# EAGLE design uext-microsd (EAGLE 7.1.0)
REVISION: rev2
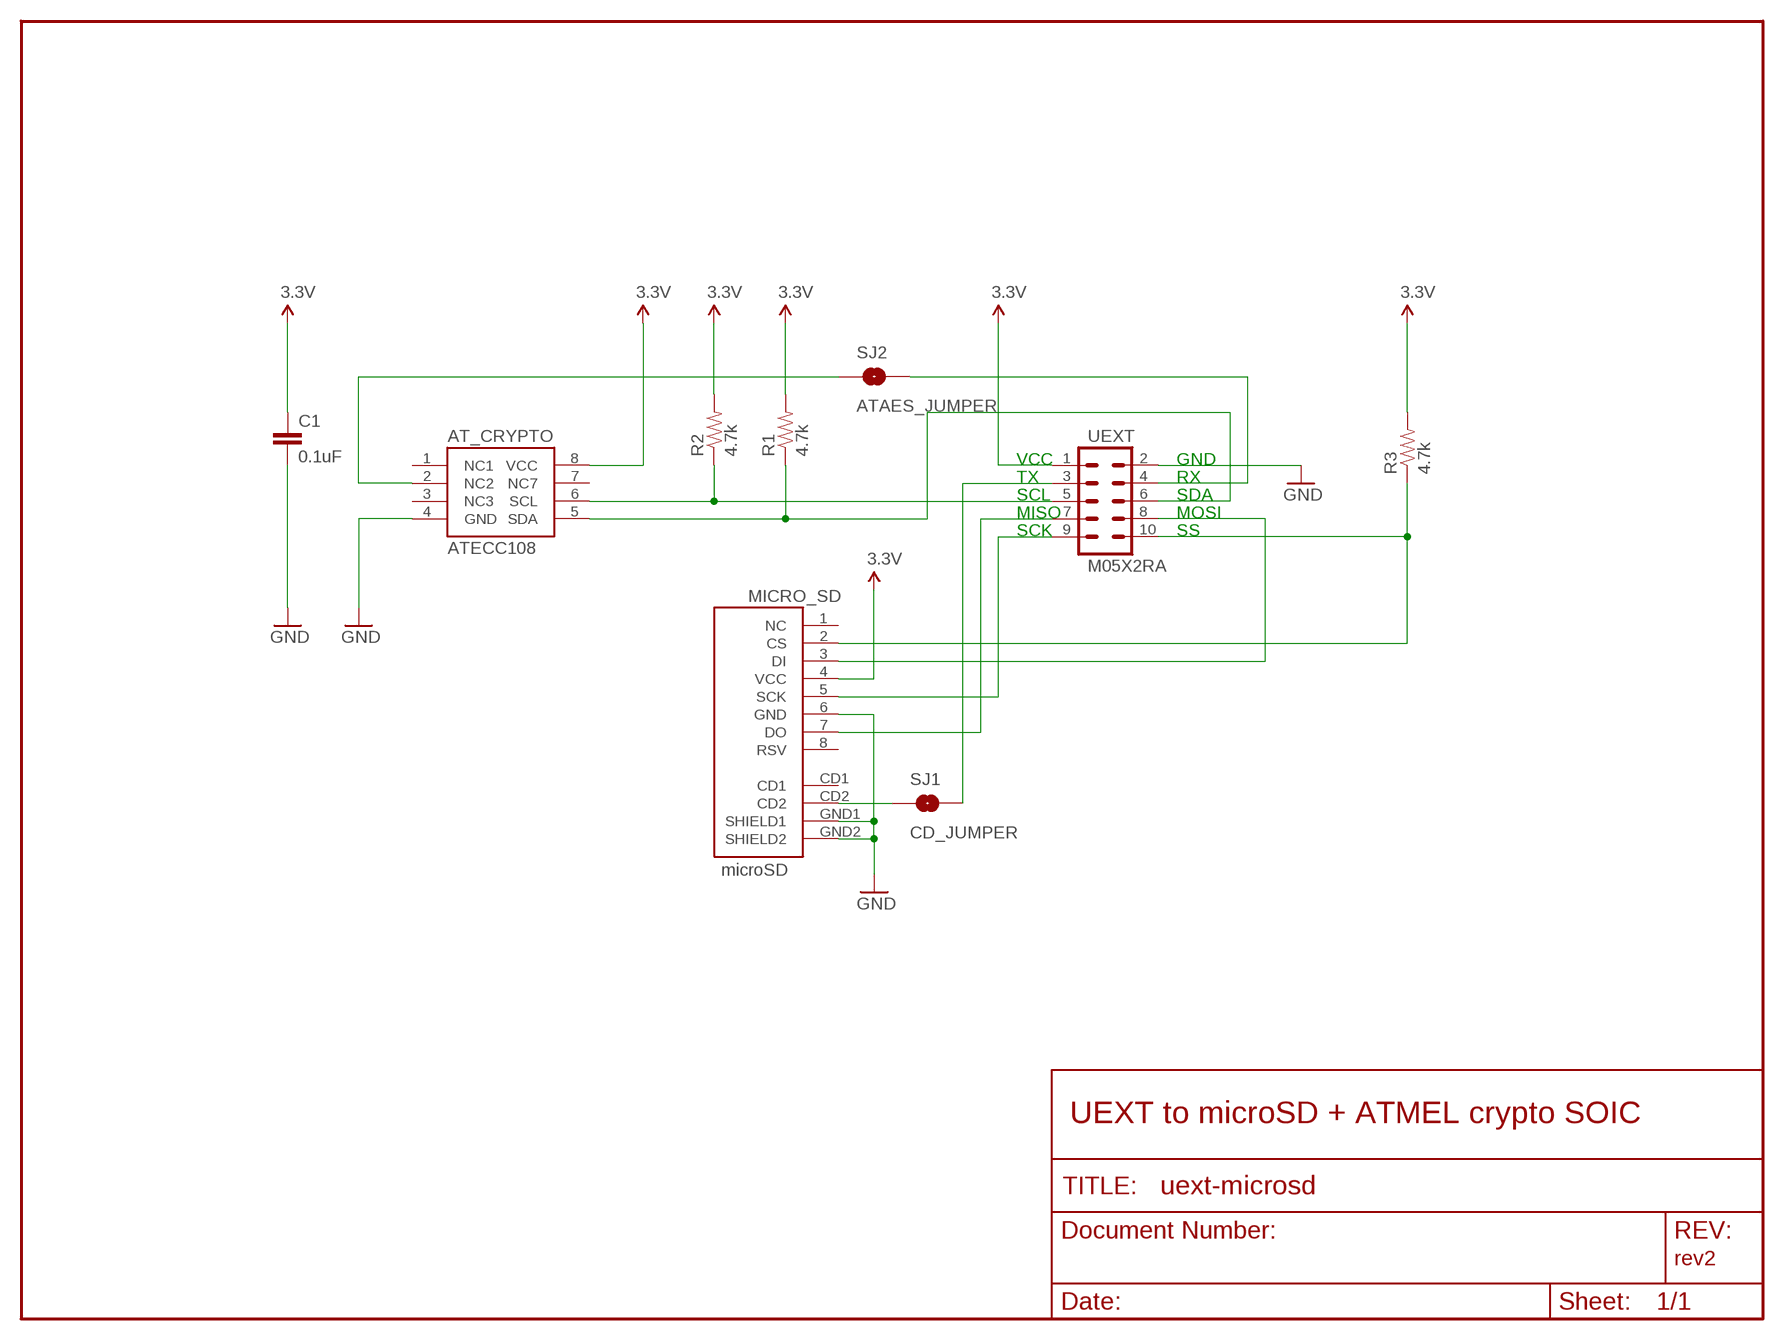
[diagram p0: schematic, sheet 1]

## Parts
AT_CRYPTO  ATECC108  [SOIC8]
C1  0.1uF  CAP1206  [1206]
MICRO_SD  microSD  USD-SOCKETSMD  [MICRO-SD-SOCKET-PP]
R1  4.7k  RESISTOR1206  [1206]
R2  4.7k  RESISTOR1206  [1206]
R3  4.7k  RESISTOR1206  [1206]
SJ1  CD_JUMPER  JUMPER-PAD-2-NOYES_SILK  [PAD-JUMPER-2-NO_YES_SILK]
SJ2  ATAES_JUMPER  JUMPER-PAD-2-NOYES_SILK  [PAD-JUMPER-2-NO_YES_SILK]
UEXT  M05X2RA  [2X5-RA]

## Nets
3.3V: AT_CRYPTO.8(VCC) C1.1 MICRO_SD.4(VCC) R1.2 R2.2 R3.2 UEXT.1
GND: AT_CRYPTO.4(GND) C1.2 MICRO_SD.6(GND) MICRO_SD.GND1(SHIELD1) MICRO_SD.GND2(SHIELD2) UEXT.2
N$1: MICRO_SD.5(SCK) UEXT.9
N$2: MICRO_SD.3(DI) UEXT.8
N$3: MICRO_SD.7(DO) UEXT.7
N$4: MICRO_SD.2(CS) R3.1 UEXT.10
N$5: SJ1.2 UEXT.3
N$6: AT_CRYPTO.6(SCL) R2.1 UEXT.5
N$7: AT_CRYPTO.5(SDA) R1.1 UEXT.6
N$8: SJ2.2 UEXT.4
N$9: AT_CRYPTO.2(NC2) SJ2.1
N$10: MICRO_SD.CD2 SJ1.1
Unconnected: AT_CRYPTO.1(NC1) AT_CRYPTO.3(NC3) AT_CRYPTO.7(NC7) MICRO_SD.1(NC) MICRO_SD.8(RSV) MICRO_SD.CD1

## Notes on the sheet
- VCC | GND
- TX | RX
- SCL | SDA
- MISO | MOSI
- SCK | SS
- UEXT to microSD + ATMEL crypto SOIC

## Library data of the parts
AT_CRYPTO = cryptotronix:ATECC108: ATECC108: Provides ECDSA with NIST curves P256, B283, and K283. Also, a RNG, 8.5Kb EEPROM. 2.0V - 5.5V.
C1 = SparkFun-Passives:CAP: Capacitor Standard 0603 ceramic capacitor, and 0.1" leaded capacitor.
MICRO_SD = SparkFun:USD-SOCKET: microSD Socket Push-push type uSD socket. Schematic element and footprint production proven. Spark Fun Electronics SKU : PRT-00127. tDoc lines correctly indicate media card edge positions when inserting (unlocked, locked, depressed).
R1-R3 = SparkFun-Passives:RESISTOR: Resistor Basic schematic elements and footprints for 0603, 1206, and PTH resistors.
SJ1 SJ2 = SparkFun-Passives:JUMPER-PAD-2-NO
UEXT = SparkFun-Connectors:M05X2: Header 5x2 Standard 10-pin dual row 0.1" header. Commonly used with AVR-ISP. Use with Spark Fun Electronics SKU: PRT-00778

## Board
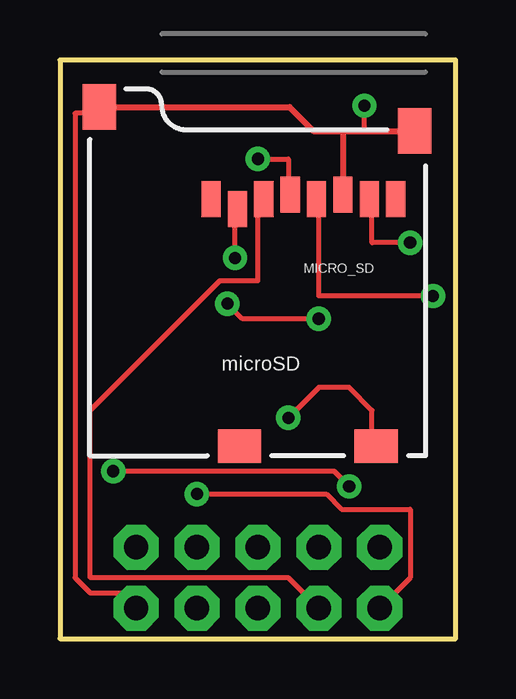
[diagram p1: board, top side]
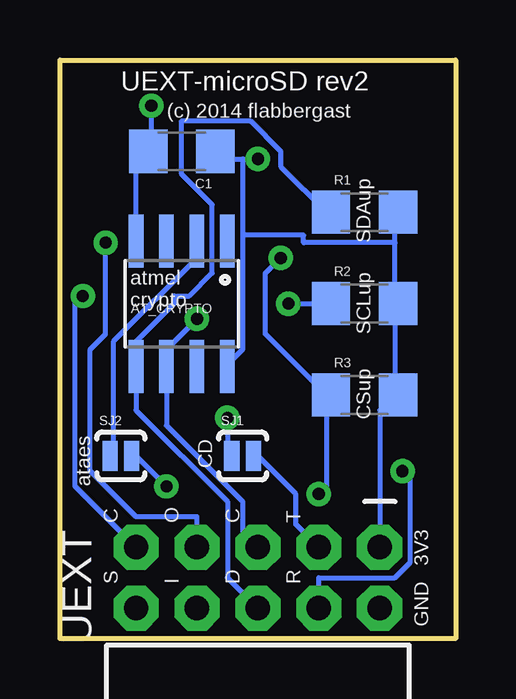
[diagram p2: board, bottom side, seen from below]

Size 16.51 x 24.13 mm. Coordinates in mm from the lower left corner, seen from the top.
Outline: 0,0 16.51,0 16.51,24.13 0,24.13 0,0
Copper layers (1*16): Top 0.035mm / dielectric 1.5mm / Bottom 0.035mm
Design rules "SparkFun": minimum track width 8mil, minimum drill 20mil, track to track 8mil, track to pad 8mil, pad to pad 8mil, via to via 8mil, smd to smd 8mil, copper to edge 10mil, drill to drill 8mil, minimum pad ring 12mil, minimum via ring 10mil, stop-mask expansion 4mil, vias tented up to drill 20mil, thermal gap 10mil

### Footprints (pad centres in the part's own frame; a part is rotated, then mirrored left to right if it is on the bottom)
SOIC8 = smd 0.61 x 2.21: 1 -1.905,-2.616; 2 -0.635,-2.616; 3 0.635,-2.616; 4 1.905,-2.616; 5 1.905,2.616; 6 0.635,2.616; 7 -0.635,2.616; 8 -1.905,2.616
1206 = smd 1.6 x 1.8: 1 -1.4,0; 2 1.4,0
MICRO-SD-SOCKET-PP = smd 0.8 x 1.5: 1 -8.94,10.7; 2 -7.84,10.3; 3 -6.74,10.7; 4 -5.64,10.9; 5 -4.54,10.7; 6 -3.44,10.9; 7 -2.34,10.7; 8 -1.24,10.7 | smd 1.8 x 1.4: CD1 -7.75,0.4; CD2 -2.05,0.4 | smd 1.4 x 1.9: GND1 -13.6,14.55; GND2 -0.45,13.55
PAD-JUMPER-2-NO_YES_SILK = smd 0.635 x 1.27: 1 -0.45,0; 2 0.45,0
2X5-RA = drill 1.016 pad 1.88 octagon: 1 -1.27,5.08; 2 1.27,5.08; 3 -1.27,2.54; 4 1.27,2.54; 5 -1.27,0; 6 1.27,0; 7 -1.27,-2.54; 8 1.27,-2.54; 9 -1.27,-5.08; 10 1.27,-5.08

### Placement (x,y rotation side)
AT_CRYPTO  11.43,13.97 180 bottom
C1  11.43,20.32 180 bottom
MICRO_SD  15.24,7.62 0 top
R1  3.81,17.78 0 bottom
R2  3.81,13.97 0 bottom
R3  3.81,10.16 0 bottom
SJ1  8.89,7.62 0 bottom
SJ2  13.97,7.62 0 bottom
UEXT  8.26,2.54 270 bottom

### Tracks (layer width: path | path; a pad name or v marks a point on that pad's centre or on a via)
3.3V  (via drill 0.51)
  Top 0.203: v8.26,20 9.53,20 9.53,18.73 MICRO_SD.4
  Bottom 0.203: 8.89,20 9.84,20 9.84,20.32 C1.1 | 8.89,20 v8.26,20 | 8.89,20 8.89,16.83 | 8.89,16.83 8.89,12.06 9.53,11.43 AT_CRYPTO.8 | 2.54,13.97 2.54,10.16 | 2.54,13.97 2.54,16.51 | 2.54,16.51 2.54,17.78 R1.2 | 2.54,13.97 R2.2 | UEXT.1 3.17,9.53 2.54,10.16 | 2.54,10.16 R3.2 | 8.89,16.83 6.35,16.83 6.35,16.51 2.54,16.51
GND  (via drill 0.51)
  Top 0.203: 12.7,21.17 v12.7,22.23 | UEXT.2 2.54,1.91 1.27,1.91 0.64,2.54 0.64,21.91 1.59,21.91 MICRO_SD.GND1
  Top 0.254: MICRO_SD.GND1 9.58,22.17 10.58,21.17 11.81,21.17 | 11.81,21.17 12.7,21.17 MICRO_SD.GND2 | MICRO_SD.6 11.8,21.16 11.81,21.17
  Bottom 0.203: AT_CRYPTO.4 13.34,20 13.02,20.32 C1.2 12.7,20.32 v12.7,22.23
N$1  (via drill 0.51)
  Top 0.203: v15.56,14.29 10.79,14.29 10.79,18.1 MICRO_SD.5
  Bottom 0.203: v15.56,14.29 15.88,13.97 15.88,6.35 UEXT.9
N$2
  Top 0.203: UEXT.8 9.53,2.54 1.27,2.54 1.27,9.53 6.67,14.92 8.26,14.92 8.26,18.1 MICRO_SD.3
N$3  (via drill 0.51)
  Top 0.203: v14.61,16.51 13.02,16.51 13.02,18.1 MICRO_SD.7
  Bottom 0.203: v14.61,16.51 14.61,12.7 15.24,12.06 15.24,6.99 13.34,5.08 10.79,5.08 UEXT.7
N$4  (via drill 0.51)
  Top 0.203: v7.3,15.88 7.3,17.78 MICRO_SD.2 | UEXT.10 14.61,2.54 14.61,5.4 11.75,5.4 11.11,6.03 v5.71,6.03
  Bottom 0.203: v7.3,15.88 7.94,15.24 7.94,12.7 5.4,10.16 | v5.71,6.03 5.4,6.35 5.4,10.16 | 5.4,10.16 R3.1
N$5
  Bottom 0.203: UEXT.3 6.67,4.76 6.67,6.03 8.26,7.62 SJ1.2
N$6  (via drill 0.51)
  Top 0.203: v6.99,13.97 7.62,13.34 v10.79,13.34
  Bottom 0.203: v6.99,13.97 R2.1 | v10.79,13.34 12.06,12.06 AT_CRYPTO.6 12.06,8.89 8.89,5.71 8.89,4.45 UEXT.5
N$7
  Bottom 0.203: R1.1 5.4,17.78 7.3,19.68 7.3,20.32 8.57,21.59 11.43,21.59 11.43,19.37 10.16,18.1 10.16,15.24 11.11,14.29 11.75,14.29 11.75,13.97 13.34,12.38 AT_CRYPTO.5 13.34,9.53 9.53,5.71 9.53,2.54 UEXT.6
N$8  (via drill 0.51)
  Top 0.203: v12.06,6.35 11.43,6.99 v2.22,6.99
  Bottom 0.203: v12.06,6.35 13.34,7.62 SJ2.2 | v2.22,6.99 1.91,6.67 1.91,3.17 2.54,2.54 5.71,2.54 UEXT.4
N$9
  Bottom 0.203: AT_CRYPTO.2 10.79,15.88 14.29,12.38 14.29,7.62 SJ2.1
N$10  (via drill 0.51)
  Top 0.203: v9.53,9.21 10.79,10.48 12.06,10.48 13.02,9.53 13.02,8.26 MICRO_SD.CD2
  Bottom 0.203: v9.53,9.21 9.53,7.62 SJ1.1

### Text on the board
tPlace: microSD
bPlace: UEXT-microSD rev2 | (c) 2014 flabbergast | SDAup | atmel / crypto | SCLup | CSup | CD | ataes | T | C | O | C | 3V3 | R | D | I | S | GND